# Altium schematic sheet 0007-Optical_Tracker.SchDoc
size B; DocumentNumber: 1; SheetNumber: 1; SheetTotal: 1; PageSetup: Record=PageOptions|CenterHorizontal=True|CenterVertical=True|PrintScale=0.70|XCorrection=1.00|YCorrection=1.00|PrintKind=1|BorderSize=5000000|LeftOffset=0|BottomOffset=0|Orientation=2|PaperLength=1000|PaperWidth=1000|Scale=100|PaperSource=15|PrintQuality=600|MediaType=1|DitherType=0|PaperKind=Letter|PrintScaleMode=1
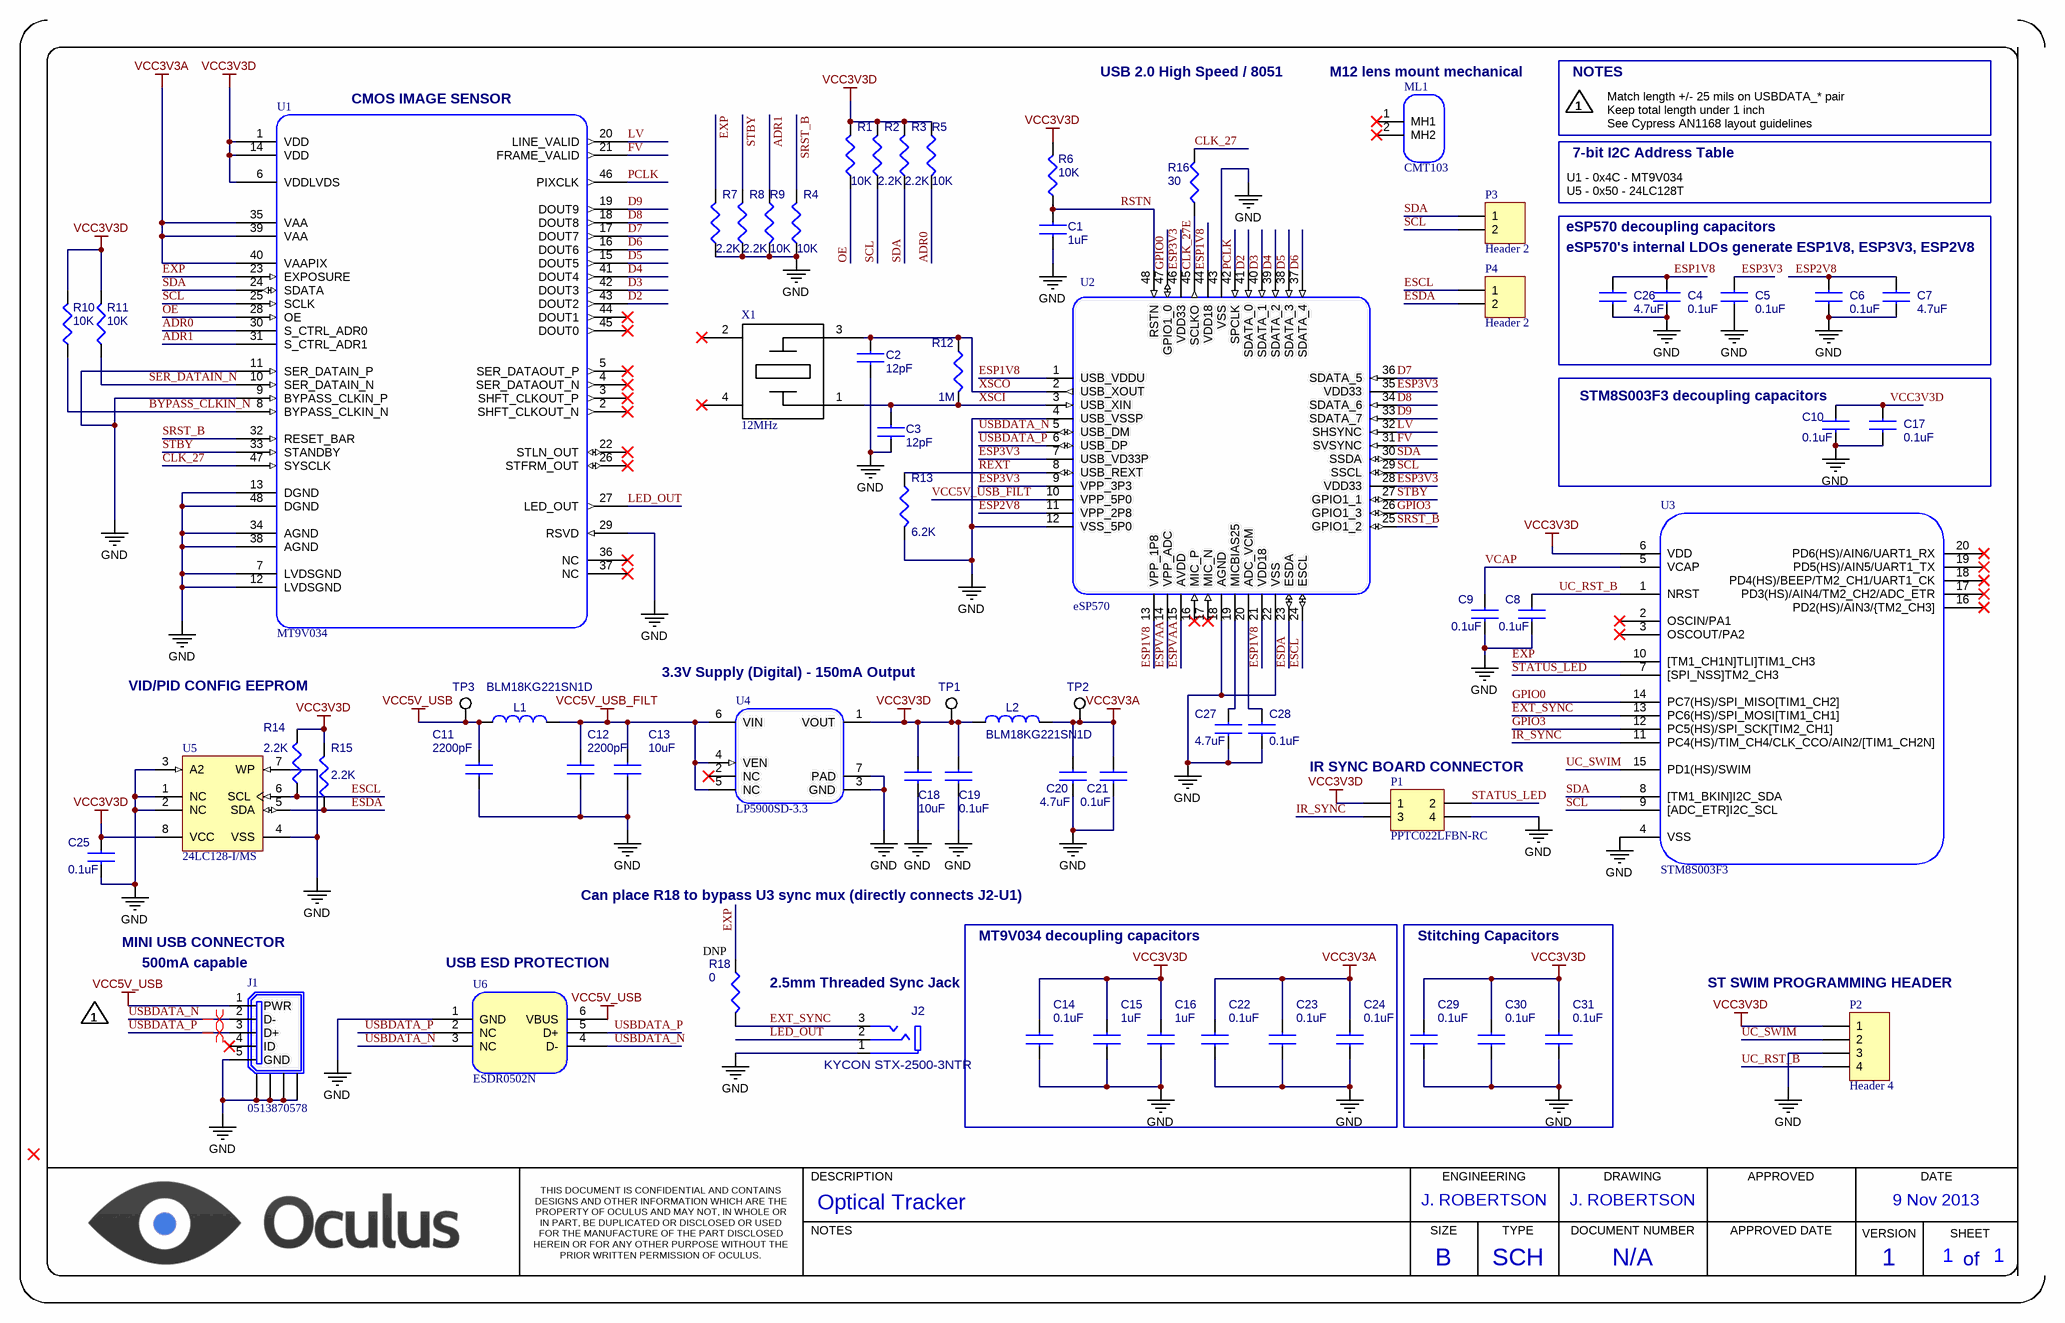
[diagram p0: 0007-Optical_Tracker.SchDoc]

## Parts
C1  1uF  [CAP_CERAMIC_0402]
C2  12pF  [CAP_CERAMIC_0402]
C3  12pF  [CAP_CERAMIC_0402]
C4  0.1uF  [CAP_CERAMIC_0402]
C5  0.1uF  [CAP_CERAMIC_0402]
C6  0.1uF  [CAP_CERAMIC_0402]
C7  4.7uF  [CAP_CERAMIC_0402]
C8  0.1uF  [CAP_CERAMIC_0402]
C9  0.1uF  [CAP_CERAMIC_0402]
C10  0.1uF  [CAP_CERAMIC_0402]
C11  2200pF  [CAP_CERAMIC_0402]
C12  2200pF  [CAP_CERAMIC_0402]
C13  10uF  [CAP_CERAMIC_0603]
C14  0.1uF  [CAP_CERAMIC_0402]
C15  1uF  [CAP_CERAMIC_0402]
C16  1uF  [CAP_CERAMIC_0402]
C17  0.1uF  [CAP_CERAMIC_0402]
C18  10uF  [CAP_CERAMIC_0603]
C19  0.1uF  [CAP_CERAMIC_0402]
C20  4.7uF  [CAP_CERAMIC_0402]
C21  0.1uF  [CAP_CERAMIC_0402]
C22  0.1uF  [CAP_CERAMIC_0402]
C23  0.1uF  [CAP_CERAMIC_0402]
C24  0.1uF  [CAP_CERAMIC_0402]
C25  0.1uF  [CAP_CERAMIC_0402]
C26  4.7uF  [CAP_CERAMIC_0402]
C27  4.7uF  [CAP_CERAMIC_0402]
C28  0.1uF  [CAP_CERAMIC_0402]
C29  0.1uF  [CAP_CERAMIC_0402]
C30  0.1uF  [CAP_CERAMIC_0402]
C31  0.1uF  [CAP_CERAMIC_0402]
J1  0513870578  [0513870578]
J2  KYCON STX-2500-3NTR  [KYCON_STX2500]
L1  BLM18KG221SN1D  [INDUCTOR_0603]
L2  BLM18KG221SN1D  [INDUCTOR_0603]
ML1  CMT103  [CMT103]  (no BOM)
P1  PPTC022LFBN-RC  [HDR2X2]
P2  Header 4  [HDR1X4]  (no BOM)
P3  Header 2  [HDR1X2]  (no BOM)
P4  Header 2  [HDR1X2]  (no BOM)
R1  10K  [RESISTOR_0402]
R2  2.2K  [RESISTOR_0402]
R3  2.2K  [RESISTOR_0402]
R4  10K  [RESISTOR_0402]
R5  10K  [RESISTOR_0402]
R6  10K  [RESISTOR_0402]
R7  2.2K  [RESISTOR_0402]
R8  2.2K  [RESISTOR_0402]
R9  10K  [RESISTOR_0402]
R10  10K  [RESISTOR_0402]
R11  10K  [RESISTOR_0402]
R12  1M  [RESISTOR_0402]
R13  6.2K  [RESISTOR_0402]
R14  2.2K  [RESISTOR_0402]
R15  2.2K  [RESISTOR_0402]
R16  30  [RESISTOR_0402]
R18  0  [RESISTOR_0402]  (no BOM)
TP1  TEST POINT  [TEST_POINT_PAD]  (value not drawn)  (no BOM)
TP2  TEST POINT  [TEST_POINT_PAD]  (value not drawn)  (no BOM)
TP3  TEST POINT  [TEST_POINT_PAD]  (value not drawn)  (no BOM)
U1  MT9V034  [CLCC-48]
U2  eSP570  [LQFP-48_M]
U3  STM8S003F3  [20-UFQFN]
U4  LP5900SD-3.3  [LLP-6]
U5  24LC128-I/MS  [MSOP-MS8_N]
U6  ESDR0502N  [UDFN-6]
X1  12MHz  [4-SMD]

## Blocks framed on the sheet
STM8S003F3 decoupling capacitors: C10 C17
MT9V034 decoupling capacitors: C14-C16 C22-C24
Stitching Capacitors: C29-C31

## Nets
GND: C1.1 C2.1 C3.1 C4.2 C5.2 C6.2 C7.2 C8.2 C9.2 C10.2 C11.2 C12.2 C13.2 C14.2 C15.2 C16.2 C17.2 C18.2 C19.2 C20.2 C21.2 C22.2 C23.2 C24.2 C25.2 C26.2 C27.2 C28.2 C29.2 C30.2 C31.2 J1.5(GND) J1.6(SHIELD) J1.7(SHIELD) J1.8(SHIELD) J1.9(SHIELD) J2.1 P1.4 P2.3 R4.1 R7.1 R8.1 R9.2 R13.2 U1.7(LVDSGND) U1.9(BYPASS_CLKIN_P) U1.11(SER_DATAIN_P) U1.12(LVDSGND) U1.13(DGND) U1.29(RSVD) U1.34(AGND) U1.38(AGND) U1.48(DGND) U2.4(USB_VSSP) U2.12(VSS_5P0) U2.18(AGND) U2.22(VSS) U2.43(VSS) U3.4(VSS) U4.3(GND) U4.7(PAD) U5.1(NC) U5.2(NC) U5.3(A2) U5.4(VSS) U5.7(WP) U6.1(GND)
VCC3V3A: C20.1 C21.1 C22.1 C23.1 C24.1 L2.2 TP2.1 U1.35(VAA) U1.39(VAA) U1.40(VAAPIX)
VCC3V3D: C10.1 C14.1 C15.1 C16.1 C17.1 C18.1 C19.1 C25.1 C29.1 C30.1 C31.1 L2.1 P1.1 P2.1 R1.2 R2.2 R3.2 R5.1 R6.2 R10.2 R11.2 R14.2 R15.2 TP1.1 U1.1(VDD) U1.6(VDDLVDS) U1.14(VDD) U3.6(VDD) U4.1(VOUT) U5.8(VCC)
VCC5V_USB: C11.1 J1.1(PWR) L1.1 TP3.1 U6.6(VBUS)
VCC5V_USB_FILT: C12.1 C13.1 L1.2 U2.10(VPP_5P0) U4.4(VEN) U4.5(NC) U4.6(VIN)
ADR0: R5.2 U1.30(S_CTRL_ADR0)
ADR1: R9.1 U1.31(S_CTRL_ADR1)
BYPASS_CLKIN_N: R10.1 U1.8(BYPASS_CLKIN_N)
CLK_27: R16.2 U1.47(SYSCLK)
CLK_27E: R16.1 U2.45(SCLKO)
D2: U1.43(DOUT2) U2.41(SDATA_0)
D3: U1.42(DOUT3) U2.40(SDATA_1)
D4: U1.41(DOUT4) U2.39(SDATA_2)
D5: U1.15(DOUT5) U2.38(SDATA_3)
D6: U1.16(DOUT6) U2.37(SDATA_4)
D7: U1.17(DOUT7) U2.36(SDATA_5)
D8: U1.18(DOUT8) U2.34(SDATA_6)
D9: U1.19(DOUT9) U2.33(SDATA_7)
ESCL: P4.1 R14.1 U2.24(ESCL) U5.6(SCL)
ESDA: P4.2 R15.1 U2.23(ESDA) U5.5(SDA)
ESP1V8: C4.1 C26.1 U2.1(USB_VDDU) U2.13(VPP_1P8) U2.21(VDD18) U2.44(VDD18)
ESP2V8: C6.1 C7.1 U2.11(VPP_2P8)
ESP3V3: C5.1 U2.7(USB_VD33P) U2.9(VPP_3P3) U2.28(VDD33) U2.35(VDD33) U2.46(VDD33)
ESPVAA: U2.14(VPP_ADC) U2.15(AVDD)
EXP: R7.2 R18.1 U1.23(EXPOSURE) U3.10([TM1_CH1N]TLI]TIM1_CH3)
EXT_SYNC: J2.3 R18.2 U3.13(PC6(HS)/SPI_MOSI[TIM1_CH1])
FV: U1.21(FRAME_VALID) U2.31(SVSYNC)
GPIO0: U2.47(GPIO1_0) U3.14(PC7(HS)/SPI_MISO[TIM1_CH2])
GPIO3: U2.26(GPIO1_3) U3.12(PC5(HS)/SPI_SCK[TIM2_CH1])
IR_SYNC: P1.3 U3.11(PC4(HS)/TIM_CH4/CLK_CCO/AIN2/[TIM1_CH2N])
LED_OUT: J2.2 U1.27(LED_OUT)
LV: U1.20(LINE_VALID) U2.32(SHSYNC)
OE: R1.1 U1.28(OE)
PCLK: U1.46(PIXCLK) U2.42(SPCLK)
REXT: R13.1 U2.8(USB_REXT)
RSTN: C1.2 R6.1 U2.48(RSTN)
SCL: P3.2 R2.1 U1.25(SCLK) U2.29(SSCL) U3.9([ADC_ETR]I2C_SCL)
SDA: P3.1 R3.1 U1.24(SDATA) U2.30(SSDA) U3.8([TM1_BKIN]I2C_SDA)
SER_DATAIN_N: R11.1 U1.10(SER_DATAIN_N)
SRST_B: R4.2 U1.32(RESET_BAR) U2.25(GPIO1_2)
STATUS_LED: P1.2 U3.7([SPI_NSS]TM2_CH3)
STBY: R8.2 U1.33(STANDBY) U2.27(GPIO1_1)
UC_RST_B: C8.1 P2.4 U3.1(NRST)
UC_SWIM: P2.2 U3.15(PD1(HS)/SWIM)
USBDATA_N: J1.2(D-) U2.5(USB_DM) U6.3(NC) U6.4(D-)
USBDATA_P: J1.3(D+) U2.6(USB_DP) U6.2(NC) U6.5(D+)
VCAP: C9.1 U3.5(VCAP)
XSCI: C3.2 R12.2 U2.3(USB_XIN) X1.1
XSCO: C2.2 R12.1 U2.2(USB_XOUT) X1.3
NetC27_1: C27.1 U2.19(MICBIAS25)
NetC28_1: C28.1 U2.20(ADC_VCM)

Not connected (* = marked no-connect by the designer): J1 4(ID)*; ML1 1(MH1)* 2(MH2)*; U1 2(SHFT_CLKOUT_N)* 3(SHFT_CLKOUT_P)* 4(SER_DATAOUT_N)* 5(SER_DATAOUT_P)* 22(STLN_OUT)* 26(STFRM_OUT)* 36(NC)* 37(NC)* 44(DOUT1)* 45(DOUT0)*; U2 16(MIC_P)* 17(MIC_N)*; U3 2(OSCIN/PA1)* 3(OSCOUT/PA2)* 16(PD2(HS)/AIN3/{TM2_CH3])* 17(PD3(HS)/AIN4/TM2_CH2/ADC_ETR)* 18(PD4(HS)/BEEP/TM2_CH1/UART1_CK)* 19(PD5(HS)/AIN5/UART1_TX)* 20(PD6(HS)/AIN6/UART1_RX)*; U4 2(NC)*; X1 2* 4*

## Layout directives
differential pair: USBDATA_N, USBDATA_P

## Notes on the sheet
- (near U1) CMOS IMAGE SENSOR
- USB 2.0 High Speed / 8051
- (near ML1) M12 lens mount mechanical
- 1
- NOTES
- 7-bit I2C Address Table
- Match length +/- 25 mils on USBDATA_* pair
  Keep total length under 1 inch
  See Cypress AN1168 layout guidelines
- U1 - 0x4C - MT9V034
  U5 - 0x50 - 24LC128T
- eSP570 decoupling capacitors
- eSP570's internal LDOs generate ESP1V8, ESP3V3, ESP2V8
- VID/PID CONFIG EEPROM
- 3.3V Supply (Digital) - 150mA Output
- (near P1) IR SYNC BOARD CONNECTOR
- Can place R18 to bypass U3 sync mux (directly connects J2-U1)
- MINI USB CONNECTOR
- (near J1) 500mA capable
- (near U6) USB ESD PROTECTION
- (near R18) DNP
- 2.5mm Threaded Sync Jack
- (near P2) ST SWIM PROGRAMMING HEADER
- DESCRIPTION
- ENGINEERING
- DRAWING
- APPROVED
- DATE
- Optical Tracker
- J. ROBERTSON
- SIZE
- TYPE
- DOCUMENT NUMBER
- APPROVED DATE
- VERSION
- 9 Nov 2013
- SHEET
- of
- THIS DOCUMENT IS CONFIDENTIAL AND CONTAINS DESIGNS AND OTHER INFORMATION WHICH ARE THE PROPERTY OF OCULUS AND MAY NOT, IN WHOLE OR IN PART, BE DUPLICATED OR DISCLOSED OR USED FOR THE MANUFACTURE OF THE PART DISCLOSED HEREIN OR FOR ANY OTHER PURPOSE WITHOUT THE PRIOR WRITTEN PERMISSION OF OCULUS.
- B
- SCH
- N/A

## Library data of the parts
C1 C15 C16 = CAP, CERAMIC: CAP CER 1UF 6.3V 20% X5R 0402; Supplier 1: Digi-Key; Supplier Part Number 1: PCC2257CT-ND
C2 C3 = CAP, CERAMIC: CAP CER 12PF 50V 5% NP0 0402; Supplier 1: Digi-Key; Supplier Part Number 1: 399-1013-1-ND
C4-C6 C8-C10 C14 C17 C19 C21-C25 C28-C31 = CAP, CERAMIC: CAP CER 0.1UF 6.3V 20% X5R 0402; Supplier 1: Digi-Key; Supplier Part Number 1: 399-8944-1-ND
C7 C20 C26 C27 = CAP, CERAMIC: CAP CER 4.7UF 6.3V 20% X5R 0402; Supplier 1: Digi-Key; Supplier Part Number 1: 587-2787-1-ND
C11 C12 = CAP, CERAMIC: CAP CER 2200PF 50V 10% X7R 0402; Supplier 1: Digi-Key; Supplier Part Number 1: 490-1305-1-ND
C13 C18 = CAP, CERAMIC: CAP CER 10UF 6.3V 20% X5R 0603; Supplier 1: Digi-Key; Supplier Part Number 1: 445-6853-1-ND
J1 = 0513870578: CONN RECEPT MINIUSB R/A 5POS SMD; Supplier 1: Digi-Key; Supplier Part Number 1: WM5462CT-ND
J2 = AUDIO_JACK_3P: Phone Connectors SJ 2.5MM SMT 3POS; Manufacturer: *; ManufacturerPN: KYCON STX-2500-3NTR; Supplier 1: Mouser; Supplier Part Number 1: 806-STX-2500-3NTR
L1 L2 = INDUCTOR: FERRITE CHIP 220 OHM 2200MA 0603; Manufacturer: Murata; Part Number: BLM18KG221SN1D; Package: 0603; Supplier 1: Digi-Key; Supplier Part Number 1: 490-5255-1-ND
ML1 = CMT103: Lens holder, M12x0.5, 16.2, centered; Part Number: CMT103
P1 = Header 2X2: Header, 2-Pin, Dual row; Supplier 1: Digi-Key; Supplier Part Number 1: S7070-ND
P2 = Header 4: Header, 4-Pin
P3 P4 = Header 2: Header, 2-Pin; LatestRevisionDate: 17-Jul-2002; LatestRevisionNote: Re-released for DXP Platform.; Publisher: Altium Limited
R1 R4-R6 R9-R11 = RESISTOR: RES 10K OHM 1/10W 1% 0402 SMD; Supplier 1: Digi-Key; Supplier Part Number 1: P10.0KLCT-ND
R2 R3 R7 R8 R14 R15 = RESISTOR: RES 2.2K OHM 1/10W 1% 0402 SMD; Supplier 1: Digi-Key; Supplier Part Number 1: P2.20KLCT-ND
R12 = RESISTOR: RES 1M OHM 1/10W 1% 0402 SMD; Supplier 1: Digi-Key; Supplier Part Number 1: P1.00MLCT-ND
R13 = RESISTOR: RES 6.2K OHM 1/10W 1% 0402 SMD; Supplier 1: Digi-Key; Supplier Part Number 1: P6.20KLCT-ND
R16 = RESISTOR: RES 30 OHM 1/10W 1% 0402 SMD; Supplier 1: Digi-Key; Supplier Part Number 1: P30.0LCT-ND
R18 = RESISTOR: RES 0 OHM 1/10W 1% 0402 SMD; Supplier 1: Digi-Key; Supplier Part Number 1: P0.0JCT-ND
TP1-TP3 = TEST_POINT: Manufacturer: *; Part Number: *
U1 = MT9V034_DS_D: 1/3" WVGA 60FPS CMOS Digital Image Sensor Global Shutter; Part Number: MT9V034C12STC; Supplier 1: Digi-Key; Supplier Part Number 1: 557-1454-ND
U2 = eSP570: USB 2.0 Camera Bridge Controller
U3 = STM8S003F3: MCU 8BIT 8KB 16MHZ; Supplier 1: Mouser; Supplier Part Number 1: 511-STM8S003F3U6TR
U4 = LP5900SD-3.3: IC, LINEAR REGULATOR, 3.3V, 150MA, ULTRA LOW NOISE; Manufacturer: NATIONAL SEMICONDUCTOR; Part Number: LP5900SD-3.3/NOPB; Pinout verified: *; Supplier 1: Digi-Key; Supplier Part Number 1: LP5900SD-3.3/NOPBCT-ND
U5 = 24LC128-I/MS: 128Kbit, 400kHz, 2.5V, I2C Serial EEPROM, 8-Pin MSOP, Industrial Temperature; Published: 29-Jan-2009; DatasheetVersion: revR, Apr-2009; PackageVersion: revBB, Aug-2009; PackageReference: MSOP-MS8; Publisher: Altium Limited; PackageDescription: 8-Lead Plastic Micro Small Outline Package (MS) [MSOP]; Supplier 1: Digi-Key; Supplier Part Number 1: 24LC128-I/MS-ND; ComponentLink1Description: Datasheet; ComponentLink1URL: http://ww1.microchip.com/downloads/en/DeviceDoc/21191R.pdf; ComponentLink2Description: Packaging Specification; ComponentLink2URL: http://www.microchip.com/stellent/groups/techpub_sg/documents/packagingspec/en012702.pdf; ComponentLink3Description: Microchip.com Home; ComponentLink3URL: http://www.microchip.com/
U6 = ESDR0502N: TVS ARRAY LOW CAP 6UDFN; Supplier 1: Digi-Key; Supplier Part Number 1: ESDR0502NMUTBGOSCT-ND
X1 = 405C35E24M00000: CRYSTAL 12MHZ 20PF SMD; Supplier 1: Digi-Key; Supplier Part Number 1: CTX819CT-ND